# Altium schematic sheet FR5969v1.0.SchDoc
size A4
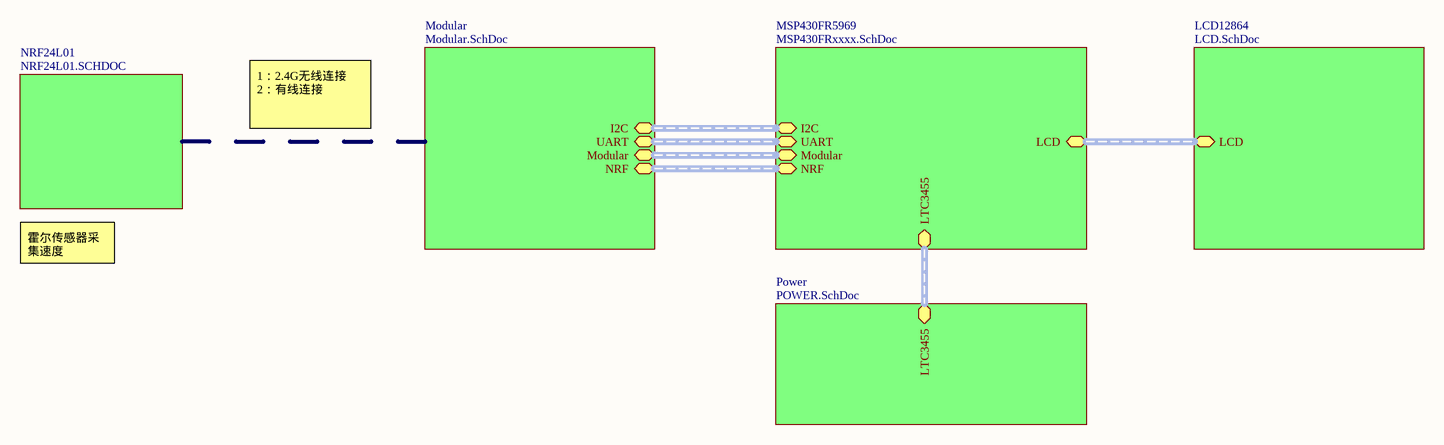
[diagram p0: FR5969v1.0.SchDoc]

## Sub-sheets
LCD12864 = LCD.SchDoc: LCD (harness LCD)
Modular = Modular.SchDoc: I2C (harness IC2), UART (harness UART), Modular (harness Modular), NRF (harness NRF)
MSP430FR5969 = MSP430FRxxxx.SchDoc: LCD (harness LCD), LTC3455 (harness LTC3455), I2C (harness IC2), UART (harness UART), Modular (harness Modular), NRF (harness NRF)
NRF24L01 = NRF24L01.SCHDOC: no entries
Power = POWER.SchDoc: LTC3455 (harness LTC3455)

## Buses and harness runs
harness sheet LCD12864/LCD = sheet MSP430FR5969/LCD
harness sheet Modular/I2C = sheet MSP430FR5969/I2C
harness sheet Modular/Modular = sheet MSP430FR5969/Modular
harness sheet Modular/NRF = sheet MSP430FR5969/NRF
harness sheet Modular/UART = sheet MSP430FR5969/UART
harness sheet MSP430FR5969/LTC3455 = sheet Power/LTC3455

## Notes on the sheet
- 1：2.4G无线连接
  2：有线连接
- 霍尔传感器采集速度